# EAGLE design question_2 (EAGLE 8.2.2)
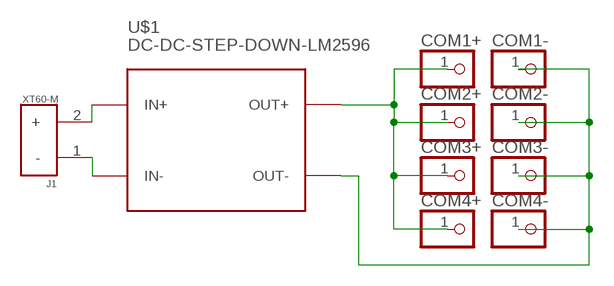
[diagram p0: schematic, sheet 1]

## Parts
COM1+  PINHD-1X1  [1X01]
COM1-  PINHD-1X1  [1X01]
COM2+  PINHD-1X1  [1X01]
COM2-  PINHD-1X1  [1X01]
COM3+  PINHD-1X1  [1X01]
COM3-  PINHD-1X1  [1X01]
COM4+  PINHD-1X1  [1X01]
COM4-  PINHD-1X1  [1X01]
J1  XT60-M  [AMASS_XT60-M]
U$1  DC-DC-STEP-DOWN-LM2596  [DC-DC-STEP-DOWN-LM2596]

## Nets
N$1: J1.1(-) U$1.IN-
N$2: J1.2(+) U$1.IN+
N$3: COM1+.1 COM2+.1 COM3+.1 COM4+.1 U$1.OUT+
N$4: COM1-.1 COM2-.1 COM3-.1 COM4-.1 U$1.OUT-

## Library data of the parts
COM1+ COM1- COM2+ COM2- COM3+ COM3- COM4+ COM4- = adafruit:PINHD-1X1: Pin header 1x1 for 0.1" spacing With round pins
J1 = XT60-M:XT60-M: DC supply; XT60; male; PIN:2; for cable; soldered; 60A; 500V; AVAILABILITY: Unavailable; DESCRIPTION: Plug; DC supply; XT60; male; PIN: 2; for cable; soldered; 30A; 500V; MF: AMASS; MP: XT60-M; PACKAGE: Package; PRICE: None
U$1 = lm2596:DC-DC-STEP-DOWN-LM2596: DC/DC Step-Down Regulator based on LM2596-ADJ chip LM2596 datasheet available here: http://www.ti.com/lit/ds/symlink/lm2596.pdf Click here to find device on ebay.com <http://www.ebay.com/sch/lm2596+power+regulator>

## Board
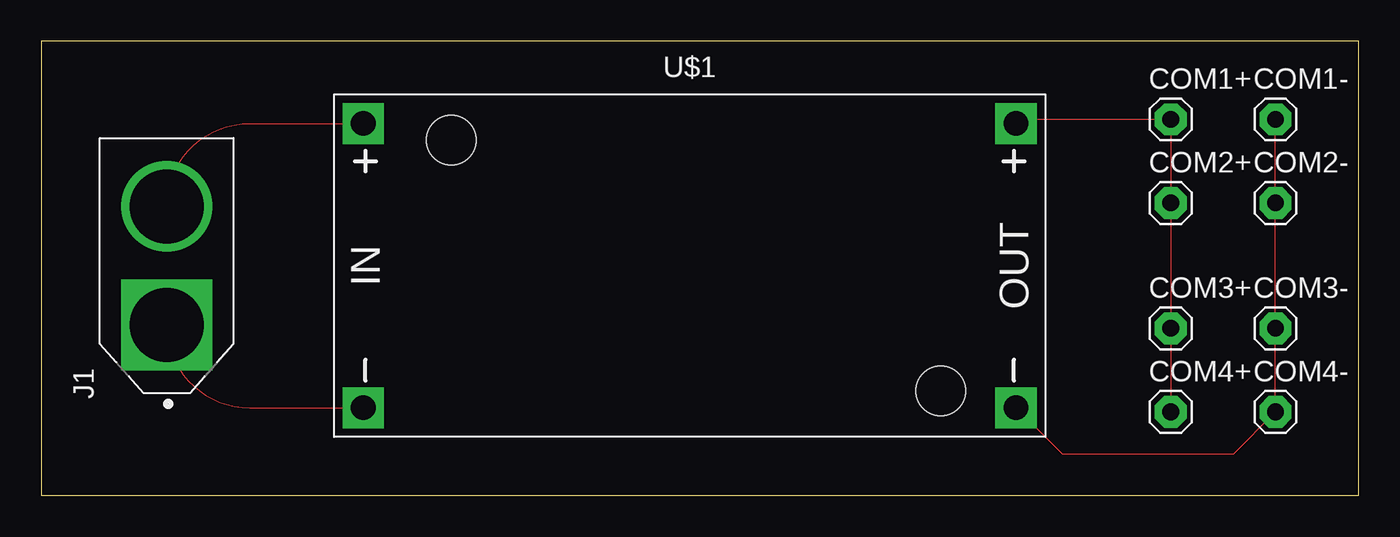
[diagram p1: board, top side]

Size 79.99 x 27.61 mm. Coordinates in mm from the lower left corner, seen from the top.
Outline: 0,0 79.99,0 79.99,27.61 0,27.61 0,0
Copper layers (1*16): Top 0.035mm / dielectric 1.5mm / Bottom 0.035mm
Design rules "default *": minimum track width 0.00126875mm, minimum drill 0.35mm, track to track 6mil, track to pad 6mil, pad to pad 6mil, via to via 6mil, smd to smd 6mil, copper to edge 40mil, drill to drill 6mil, minimum pad ring 10mil, minimum via ring 8mil, stop-mask expansion 4mil, vias tented up to drill 0mil, thermal gap 10mil

### Footprints (pad centres in the part's own frame; a part is rotated, then mirrored left to right if it is on the bottom)
1X01 = drill 1.016 pad 1.93 octagon: 1 0,0
AMASS_XT60-M = drill 4.5 square: 1 -3.6,0 | drill 4.5: 2 3.6,0
DC-DC-STEP-DOWN-LM2596 = drill 1.5 pad 2.5 square: IN+ -19.812,8.636; IN- -19.812,-8.636; OUT+ 19.812,8.636; OUT- 19.812,-8.636 | hole 3: -14.478,7.62; 15.24,-7.62

### Placement (x,y rotation side)
COM1+  68.58,22.86 0 top
COM1-  74.93,22.86 0 top
COM2+  68.58,17.78 0 top
COM2-  74.93,17.78 0 top
COM3+  68.58,10.16 0 top
COM3-  74.93,10.16 0 top
COM4+  68.58,5.08 0 top
COM4-  74.93,5.08 0 top
J1  7.62,13.97 90 top
U$1  39.37,13.97 0 top

### Tracks (layer width: path | path; a pad name or v marks a point on that pad's centre or on a via)
N$1
  Top 0.024: J1.1 arc90 12.66,5.33 U$1.IN-
N$2
  Top 0.024: J1.2 arc-90 12.66,22.61 U$1.IN+
N$3
  Top 0.024: U$1.OUT+ arc-90 59.44,22.86 COM1+.1 COM2+.1 COM3+.1 COM4+.1
N$4
  Top 0.024: U$1.OUT- 61.98,2.54 72.39,2.54 COM4-.1 COM3-.1 COM2-.1 COM1-.1